# EAGLE schematic mainboard (EAGLE 9.4.0)
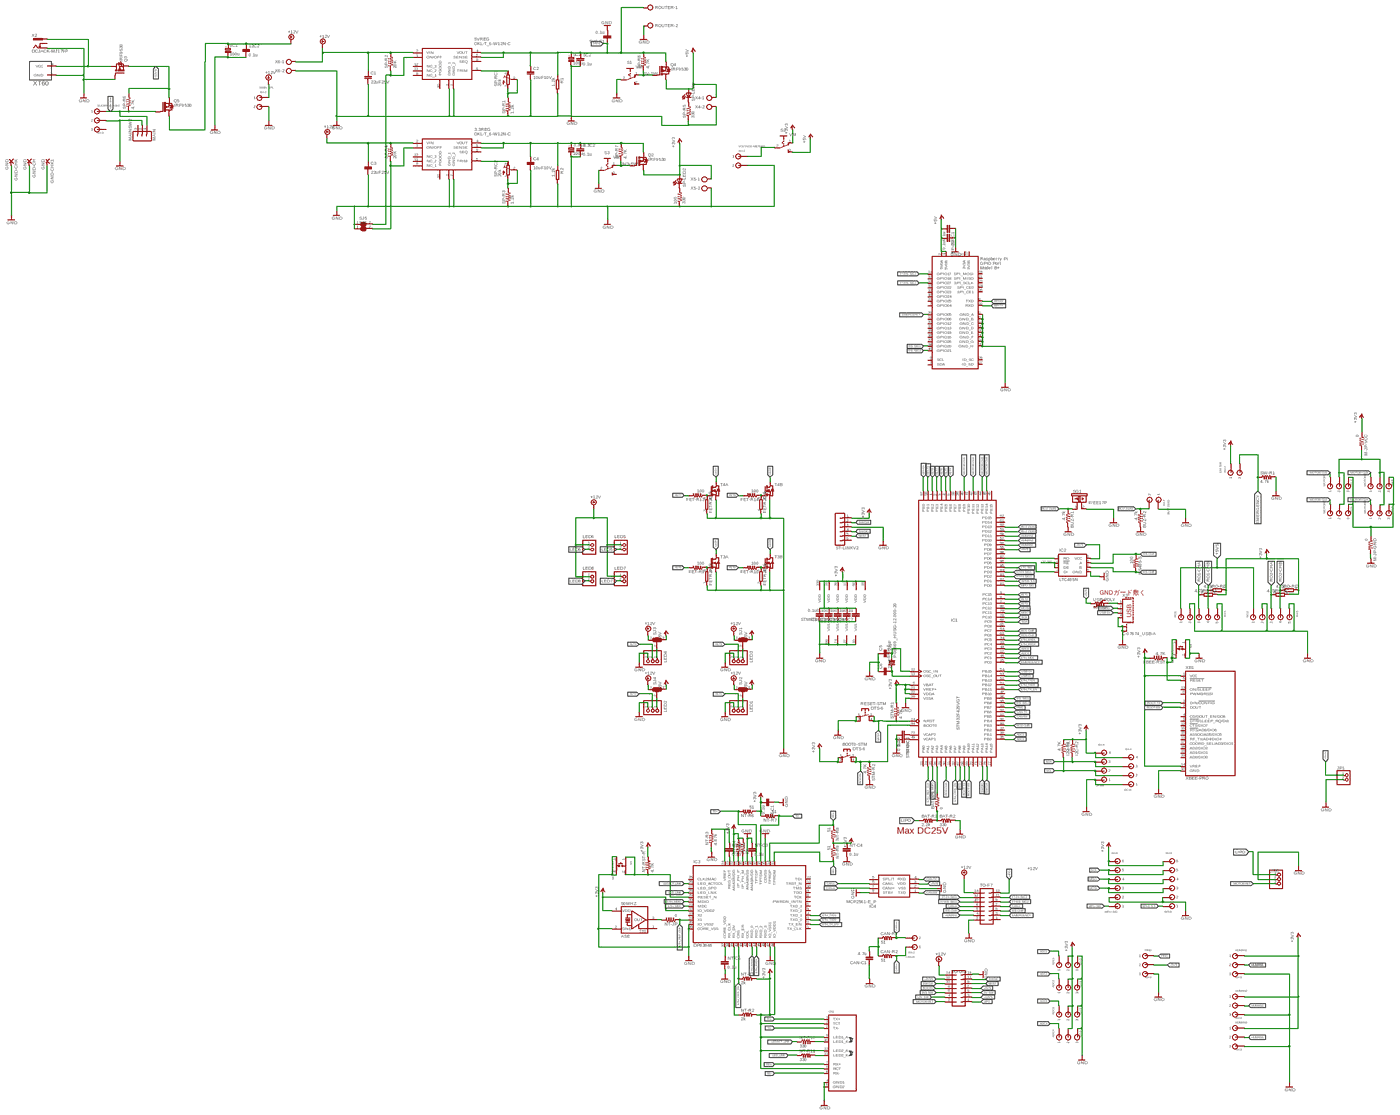
[diagram p0: schematic, sheet 1, overview]
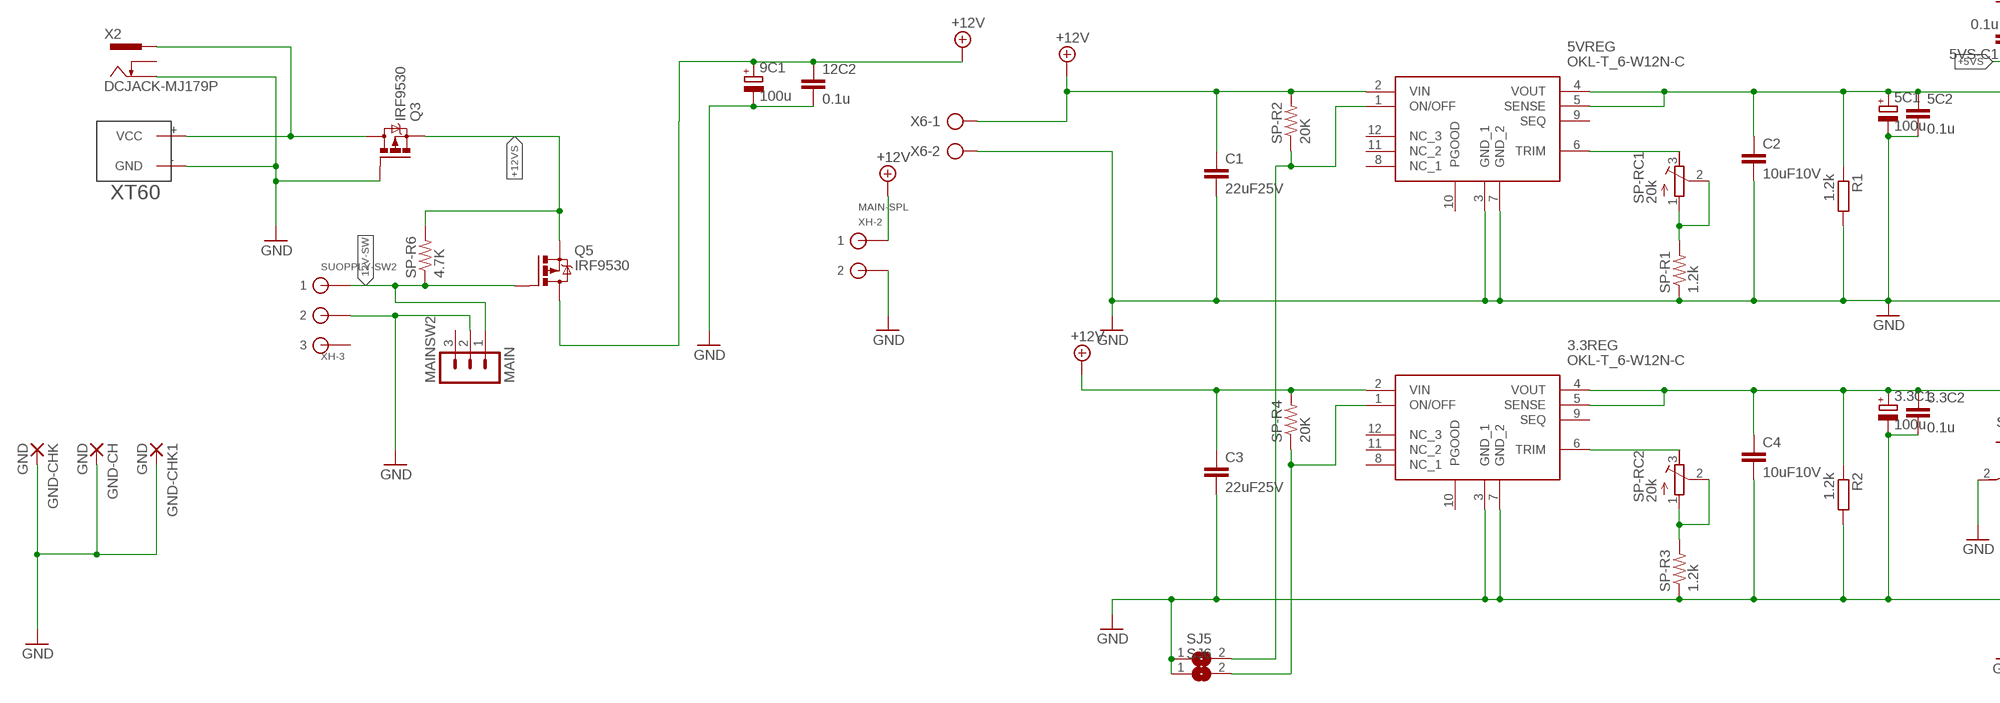
[diagram p1: schematic, sheet 1, part 1 of 4]
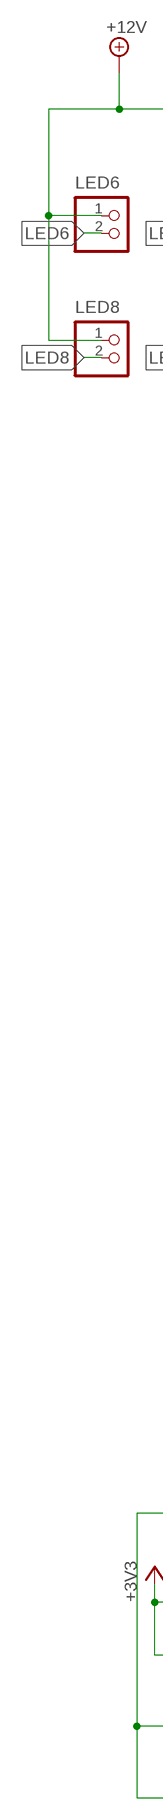
[diagram p2: schematic, sheet 1, part 2 of 4]
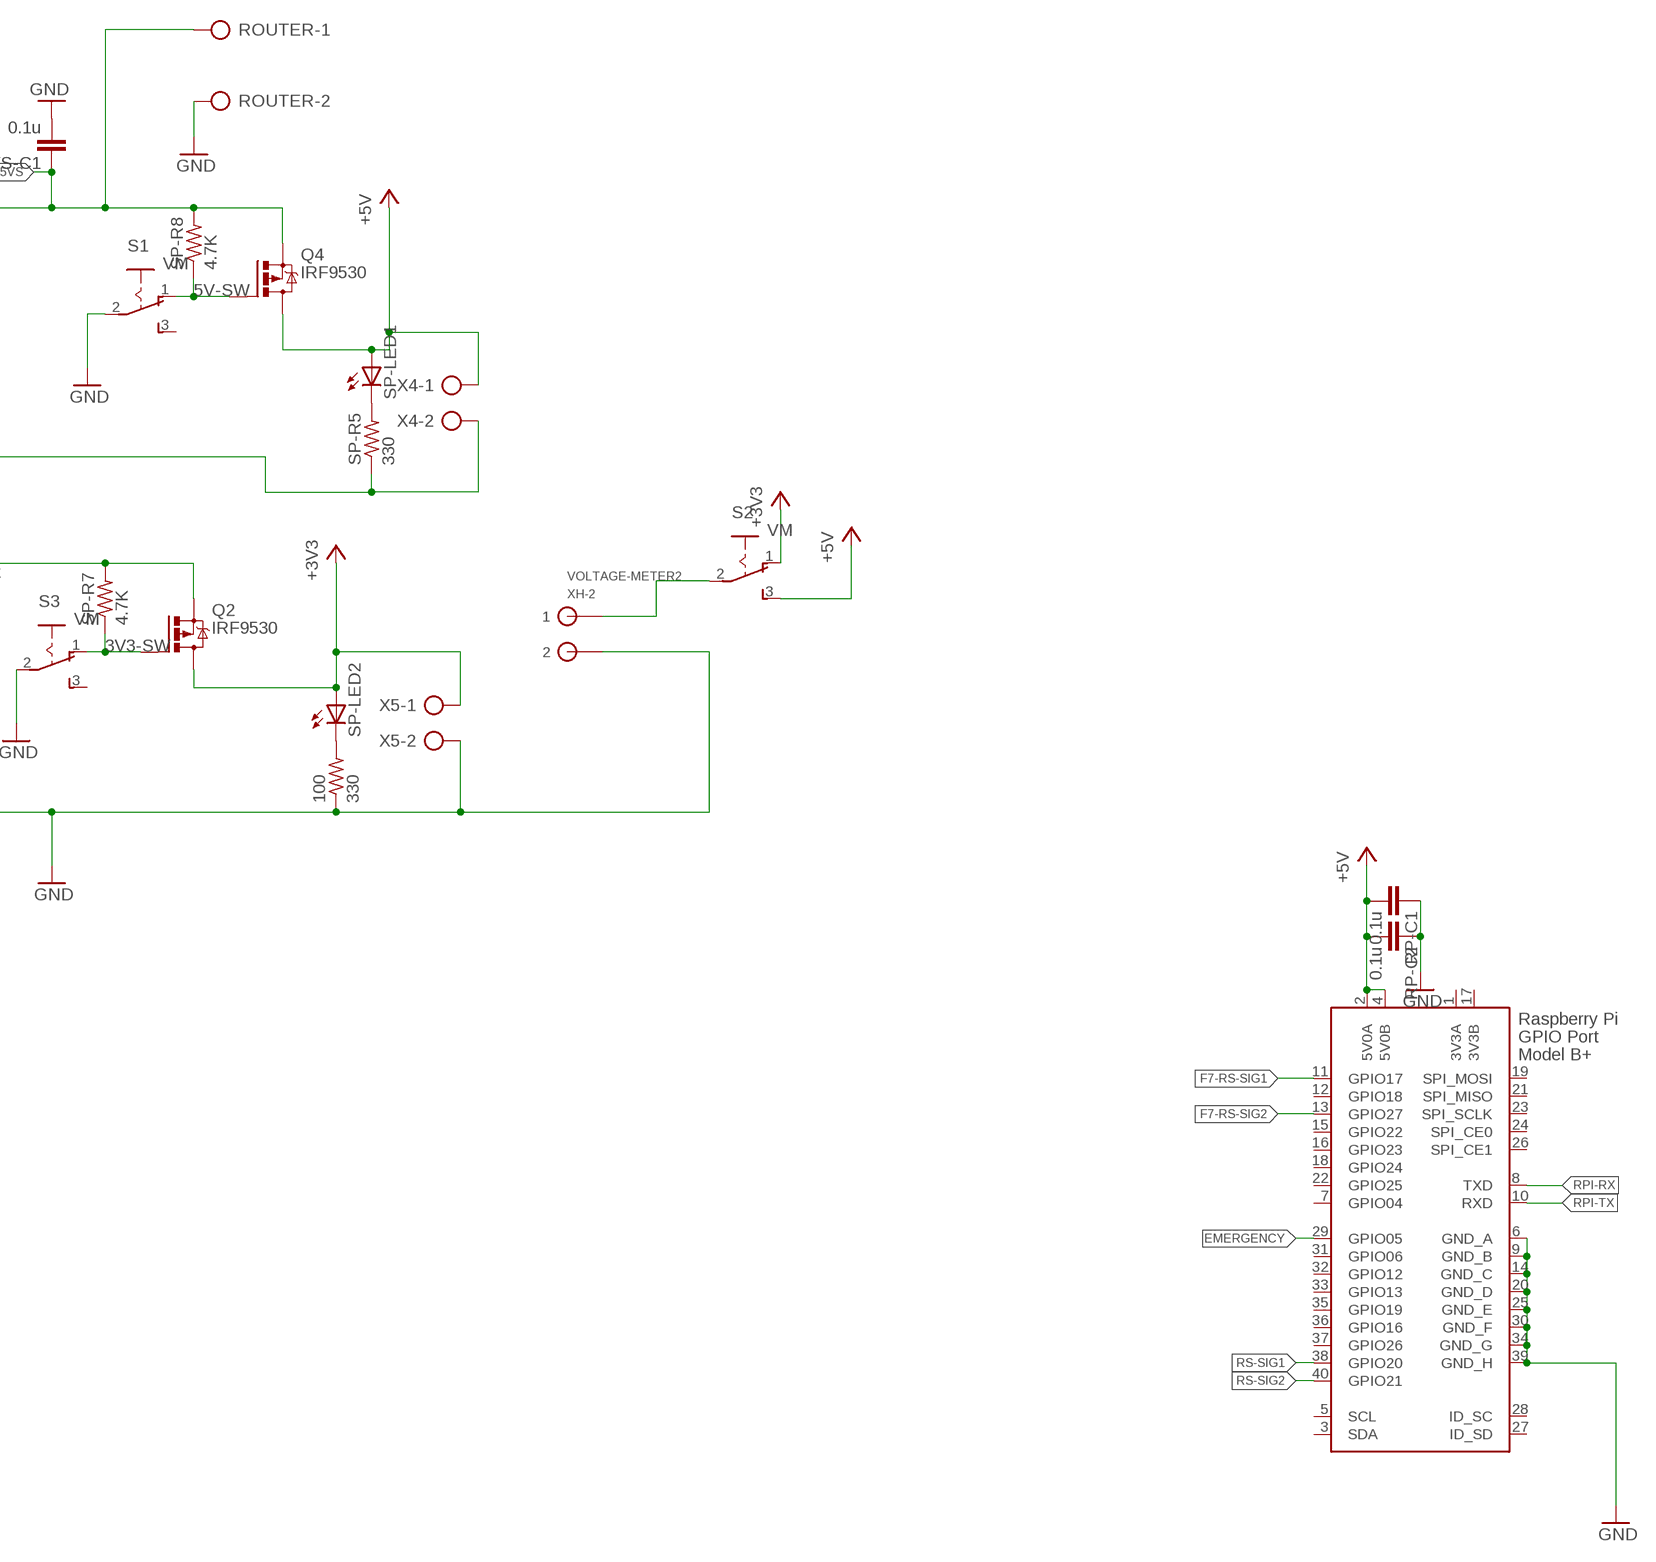
[diagram p3: schematic, sheet 1, part 3 of 4]
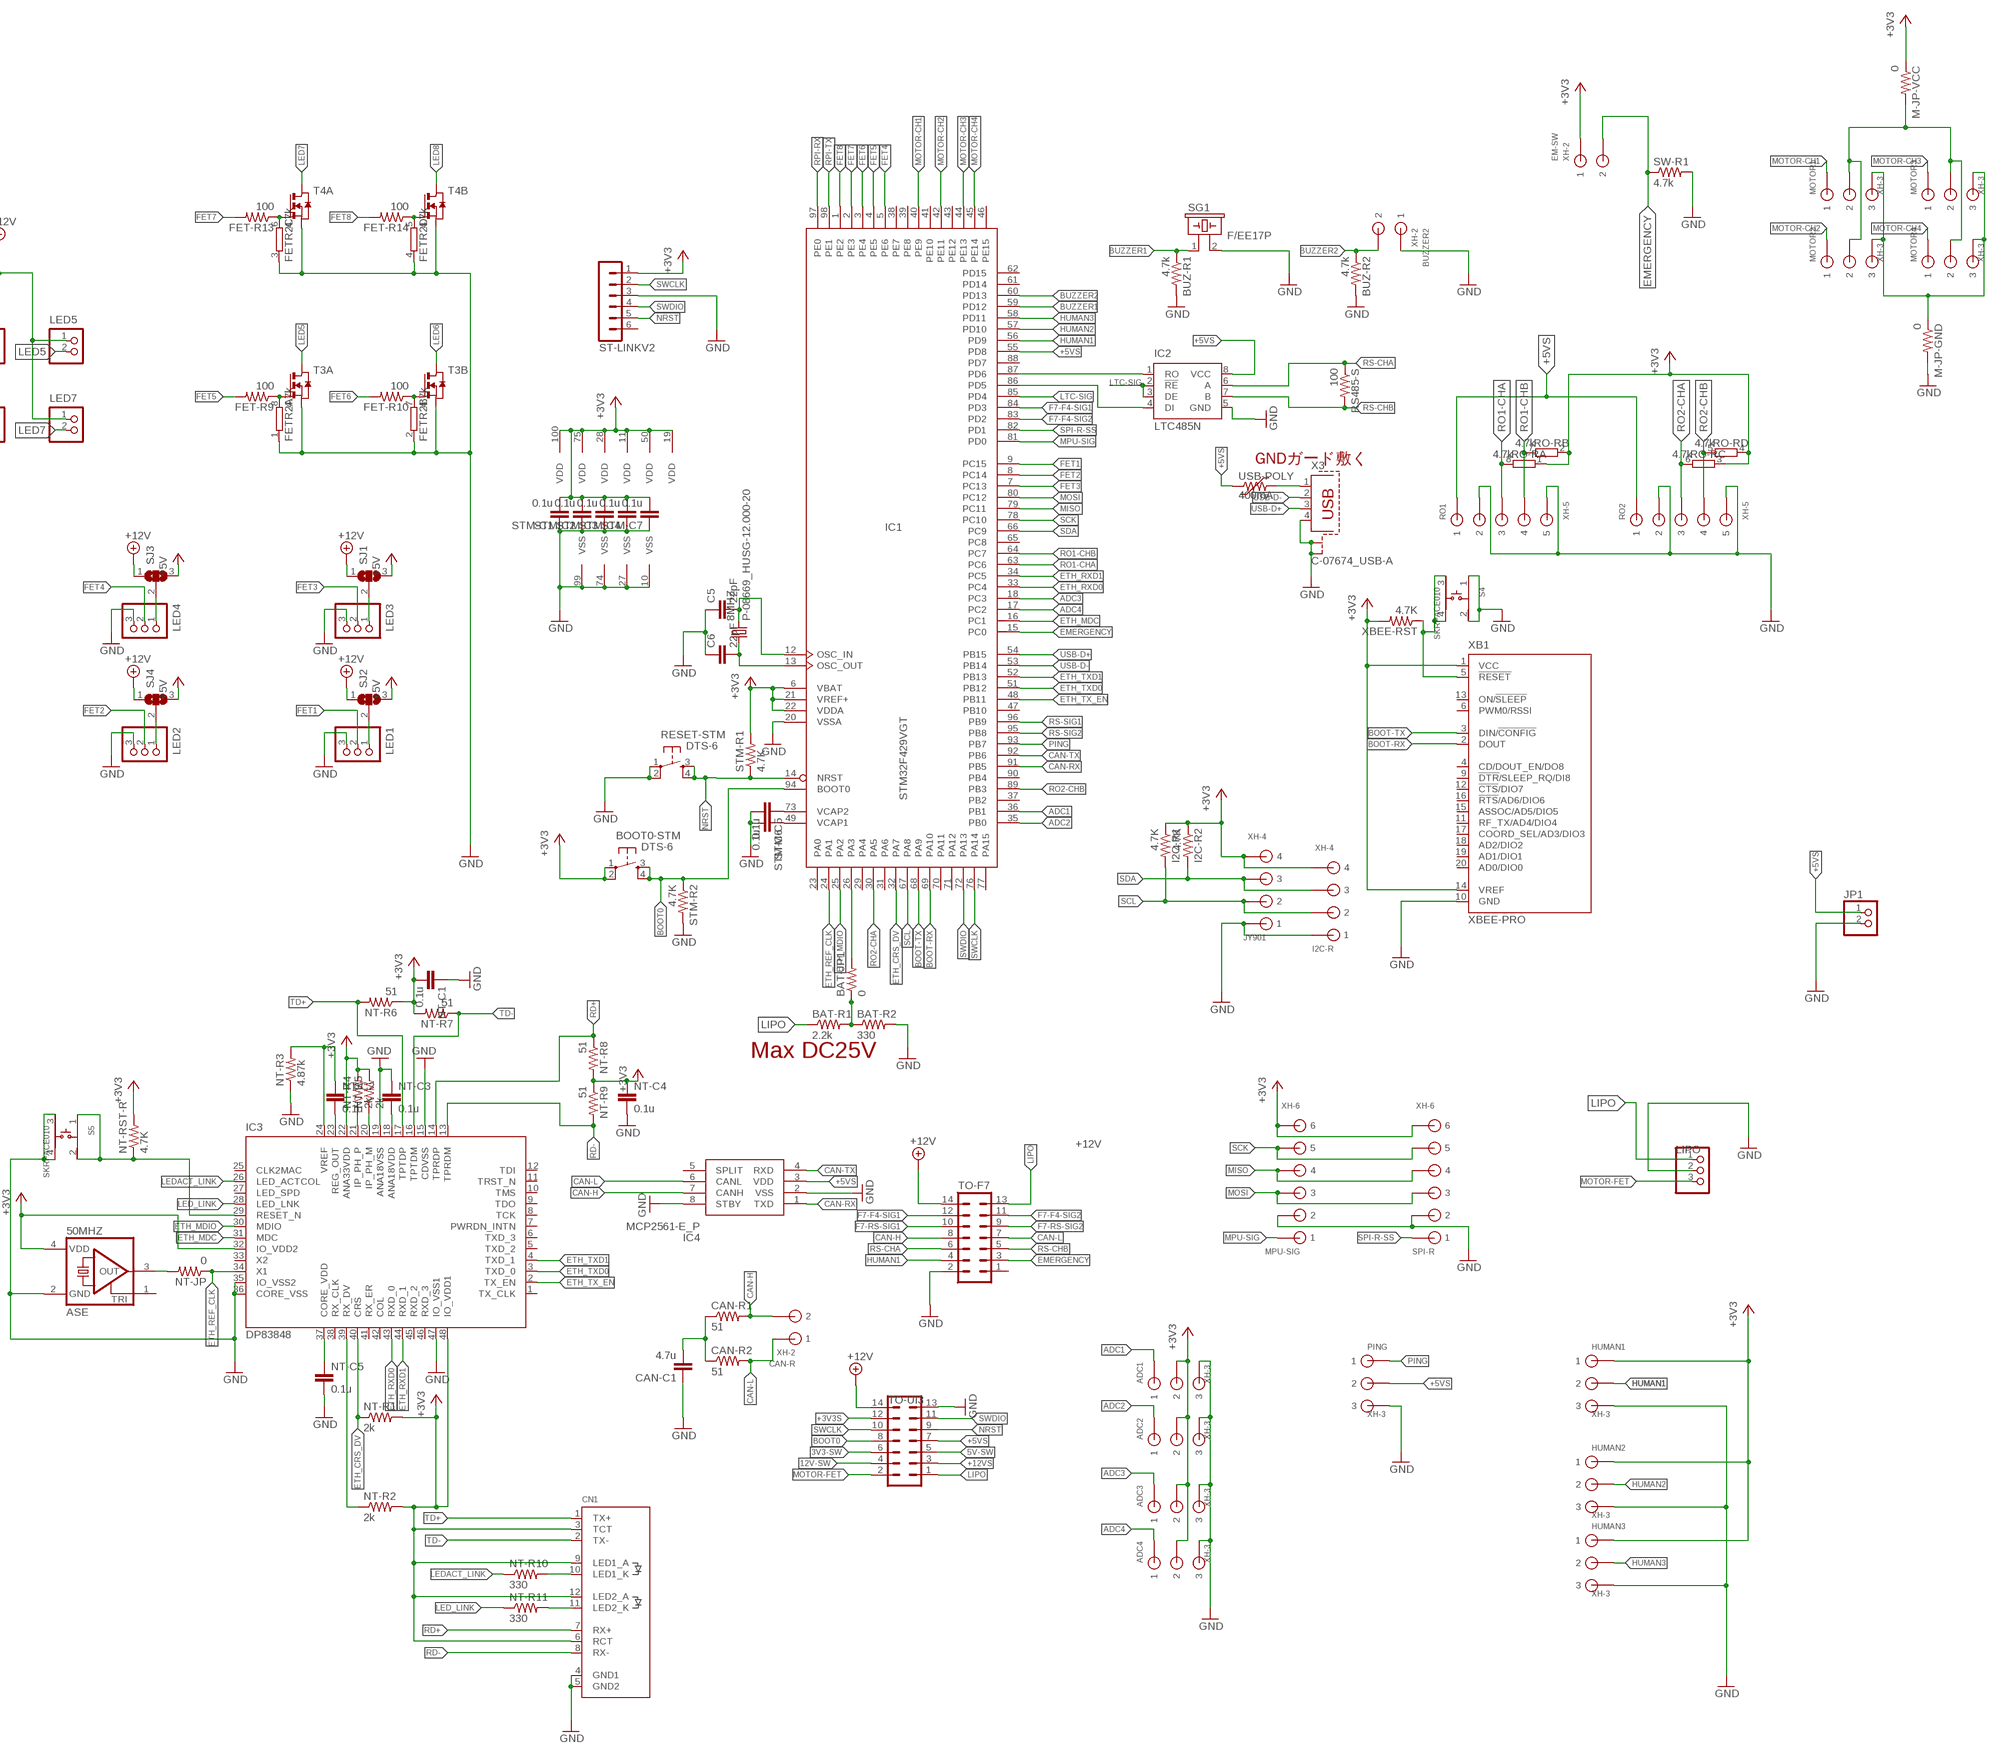
[diagram p4: schematic, sheet 1, part 4 of 4]

## Parts
3.3C1  100u  CPOL-EUD/7343-31R  [D/7343-31R]
3.3C2  0.1u  C-EUC0805  [C0805]
3.3REG  OKL-T_6-W12N-C  [OKL-T/3-W5]
5C1  100u  CPOL-EUD/7343-31R  [D/7343-31R]
5C2  0.1u  C-EUC0805  [C0805]
5VREG  OKL-T_6-W12N-C  [OKL-T/3-W5]
5VS-C1  0.1u  C-EUC0805  [C0805]
8MHZ  P-08669_HUSG-12.000-20  [HC49U-V]
9C1  100u  CPOL-EUD/7343-31R  [D/7343-31R]
12C2  0.1u  C-EUC0805  [C0805]
50MHZ  ASE  [ASE]
100  330  R-US_R0805  [R0805]
ADC1  XH-3  [CON3]
ADC2  XH-3  [CON3]
ADC3  XH-3  [CON3]
ADC4  XH-3  [CON3]
BAT-JP1  0  R-US_R0805  [R0805]
BAT-R1  2.2k  R-US_R0805  [R0805]
BAT-R2  330  R-US_R0805  [R0805]
BOOT0-STM  DTS-6  [DTS-6]
BUZ-R1  4.7k  R-US_R0805  [R0805]
BUZ-R2  4.7k  R-US_R0805  [R0805]
BUZZER2  XH-2  [CON2]
C1  22uF25V  C-EUC2012  [C2012]
C2  10uF10V  C-EUC2012  [C2012]
C3  22uF25V  C-EUC2012  [C2012]
C4  10uF10V  C-EUC2012  [C2012]
C5  22pF  C-EUC1608  [C1608]
C6  22pF  C-EUC1608  [C1608]
CAN-C1  4.7u  C-EUC0805  [C0805]
CAN-R  XH-2  [CON2]
CAN-R1  51  R-US_R0805  [R0805]
CAN-R2  51  R-US_R0805  [R0805]
CN1  P-04809_RJLD260TC1  [RJ45_PULSEJACK]
EM-SW  XH-2  [CON2]
FET-R9  100  R-US_R0805  [R0805]
FET-R10  100  R-US_R0805  [R0805]
FET-R13  100  R-US_R0805  [R0805]
FET-R14  100  R-US_R0805  [R0805]
FETR2  4.7k  4R-NEXBN8V  [EXBN8V]
GND-CH  GND  SMD5  [SMD2,54-5,08]
GND-CHK  GND  2,15/1,0  [2,15/1,0]
GND-CHK1  GND  2,15/1,0  [2,15/1,0]
HUMAN1  XH-3  [CON3]
HUMAN2  XH-3  [CON3]
HUMAN3  XH-3  [CON3]
I2C-R  XH-4  [CON4]
I2C-R1  4.7K  R-US_R0805  [R0805]
I2C-R2  4.7K  R-US_R0805  [R0805]
IC1  STM32F429VGT  [LQFP100]
IC2  LTC485N  [DIL08]
IC3  DP83848  [LQFP48]
IC4  MCP2561-E_P  [DIP781W56P254L950H533Q8N]
JP1  PINHD-1X2/90  [1X02/90]
JY901  XH-4  [CON4]
LED1  B3P-VH  [B3P-VH]
LED2  B3P-VH  [B3P-VH]
LED3  B3P-VH  [B3P-VH]
LED4  B3P-VH  [B3P-VH]
LED5  B2P-VH  [B2P-VH]
LED6  B2P-VH  [B2P-VH]
LED7  B2P-VH  [B2P-VH]
LED8  B2P-VH  [B2P-VH]
LIPO  B3P-VH  [B3P-VH]
M-JP-GND  0  R-US_R0805  [R0805]
M-JP-VCC  0  R-US_R0805  [R0805]
MAIN-SPL  XH-2  [CON2]
MAINSW2  MAIN  MA03-1  [MA03-1]
MOTOR1  XH-3  [CON3]
MOTOR2  XH-3  [CON3]
MOTOR3  XH-3  [CON3]
MOTOR4  XH-3  [CON3]
MPU-SIG  XH-6  [CON6]
NT-C1  0.1u  C-EUC0805  [C0805]
NT-C2  0.1u  C-EUC0805  [C0805]
NT-C3  0.1u  C-EUC0805  [C0805]
NT-C4  0.1u  C-EUC0805  [C0805]
NT-C5  0.1u  C-EUC0805  [C0805]
NT-JP  0  R-US_R0805  [R0805]
NT-R1  2k  R-US_R0805  [R0805]
NT-R2  2k  R-US_R0805  [R0805]
NT-R3  4.87k  R-US_R0805  [R0805]
NT-R4  2k  R-US_R0805  [R0805]
NT-R5  2k  R-US_R0805  [R0805]
NT-R6  51  R-US_R0805  [R0805]
NT-R7  51  R-US_R0805  [R0805]
NT-R8  51  R-US_R0805  [R0805]
NT-R9  51  R-US_R0805  [R0805]
NT-R10  330  R-US_R0805  [R0805]
NT-R11  330  R-US_R0805  [R0805]
NT-RST-R  4.7K  R-US_R0805  [R0805]
PING  XH-3  [CON3]
Q2  IRF9530  [TO220BV]
Q3  IRF9530  [TO220BV]
Q4  IRF9530  [TO220BV]
Q5  IRF9530  [TO220BV]
R1  1.2k  R-EU_0204/7  [0204/7]
R2  1.2k  R-EU_0204/7  [0204/7]
RESET-STM  DTS-6  [DTS-6]
RO1  XH-5  [CON5]
RO2  XH-5  [CON5]
RO-R  4.7k  4R-NEXBN8V  [EXBN8V]
ROUTER  AK500/2-H  [AK500/2-H]
RP-C1  0.1u  C-EUC0805  [C0805]
RP-C2  0.1u  C-EUC0805  [C0805]
RS485-S  100  R-US_R0805  [R0805]
S1  VM  M251  [M251]
S2  VM  M251  [M251]
S3  VM  M251  [M251]
S4  SKRPACE010  [SW_SKRPACE010]
S5  SKRPACE010  [SW_SKRPACE010]
SG1  F/EE17P  [F/EE17P]
SJ1  SJ2WW  [SJ_2W]
SJ2  SJ2WW  [SJ_2W]
SJ3  SJ2WW  [SJ_2W]
SJ4  SJ2WW  [SJ_2W]
SJ5  SJ  [SJ]
SJ6  SJ  [SJ]
SP-LED1  LEDCHIPLED_0805  [CHIPLED_0805]
SP-LED2  LEDCHIPLED_0805  [CHIPLED_0805]
SP-R1  1.2k  R-US_R0805  [R0805]
SP-R2  20K  R-US_R0805  [R0805]
SP-R3  1.2k  R-US_R0805  [R0805]
SP-R4  20K  R-US_R0805  [R0805]
SP-R5  330  R-US_R0805  [R0805]
SP-R6  4.7K  R-US_R0805  [R0805]
SP-R7  4.7K  R-US_R0805  [R0805]
SP-R8  4.7K  R-US_R0805  [R0805]
SP-RC1  20k  R-TRIMM3296W  [RTRIM3296W]
SP-RC2  20k  R-TRIMM3296W  [RTRIM3296W]
SPI-R  XH-6  [CON6]
ST-LINKV2  MA06-1  [MA06-1]
STM-C1  0.1u  C-EUC0805  [C0805]
STM-C2  0.1u  C-EUC0805  [C0805]
STM-C3  0.1u  C-EUC0805  [C0805]
STM-C4  0.1u  C-EUC0805  [C0805]
STM-C5  0.1u  C-EUC0805  [C0805]
STM-C6  0.1u  C-EUC0805  [C0805]
STM-C7  0.1u  C-EUC0805  [C0805]
STM-R1  4.7K  R-US_R0805  [R0805]
STM-R2  4.7K  R-US_R0805  [R0805]
SUOPPLY-SW2  XH-3  [CON3]
SW-R1  4.7k  R-US_R0805  [R0805]
T3  NMOS2SO8  [SO8]
T4  NMOS2SO8  [SO8]
TO-F7  ML14  [ML14]
TO-UI3  ML14  [ML14]
U$2  XT60  [XT60]
USB-POLY  400mA  PTC-F0805MP  [F0805MP]
VOLTAGE-METER2  XH-2  [CON2]
X1  RASPI_BOARD_B+#_FP  [RASPI_BOARD_B+_FULL_PAD]
X2  DCJACK-MJ179P  [MJ-179P]
X3  C-07674_USB-A  [PN87520-S]
X4  AK500/2  [AK500/2]
X5  AK500/2  [AK500/2]
X6  AK500/2  [AK500/2]
XB1  XBEE-PRO  [XBEE-PRO]
XBEE-RST  4.7K  R-US_R0805  [R0805]

## Nets
3V3-SW: Q2.G S3.1(O) SP-R7.1 TO-UI3.6
5V-SW: Q4.G S1.1(O) SP-R8.1 TO-UI3.5
12V-B: Q3.D U$2.+(VCC) X2.1
12V-SW: MAINSW2.1 Q5.G SP-R6.1 SUOPPLY-SW2.P$1 TO-UI3.4
+3V3: 50MHZ.4(VDD) ADC1.P$2 ADC2.P$2 ADC3.P$2 ADC4.P$2 BOOT0-STM.1 BOOT0-STM.2 CN1.3(TCT) CN1.6(RCT) CN1.9(LED1_A) CN1.12(LED2_A) EM-SW.P$1 HUMAN1.P$1 HUMAN2.P$1 HUMAN3.P$1 I2C-R1.1 I2C-R2.1 I2C-R.P$4 IC1.6(VBAT) IC1.11(VDD) IC1.19(VDD) IC1.21(VREF+) IC1.22(VDDA) IC1.28(VDD) IC1.50(VDD) IC1.75(VDD) IC1.100(VDD) IC3.22(ANA33VDD) IC3.32(IO_VDD2) IC3.48(IO_VDD1) JY901.P$4 M-JP-VCC.1 MPU-SIG.P$6 NT-C1.2 NT-C4.1 NT-R1.2 NT-R2.2 NT-R4.2 NT-R5.2 NT-R6.1 NT-R7.2 NT-R8.2 NT-R9.1 NT-RST-R.2 Q2.D RO-R.1 RO-R.2 RO-R.3 RO-R.4 S2.1(O) SP-LED2.A SPI-R.P$6 ST-LINKV2.1 STM-C1.2 STM-C2.2 STM-C3.2 STM-C4.2 STM-C7.2 STM-R1.2 X5.1 XB1.1(VCC) XB1.14(VREF) XBEE-RST.2
+3V3S: 3.3C1.+ 3.3C2.1 3.3REG.4(VOUT) 3.3REG.5(SENSE) C4.1 Q2.S R2.1 SP-R7.2 TO-UI3.12
+5V: Q4.D RP-C1.2 RP-C2.2 S2.3(S) SJ1.3 SJ2.3 SJ3.3 SJ4.3 SP-LED1.A X1.2(5V0A) X1.4(5V0B) X4.1
+5VS: 5C1.+ 5C2.1 5VREG.4(VOUT) 5VREG.5(SENSE) 5VS-C1.1 C2.1 IC1.55(PD8) IC2.8(VCC) IC4.3(VDD) JP1.1 PING.P$2 Q4.S R1.1 RO1.P$1 RO2.P$1 ROUTER.1 SP-R8.2 TO-UI3.7 USB-POLY.1
+12V: 3.3REG.2(VIN) 5VREG.2(VIN) 9C1.+ 12C2.1 C1.1 C3.1 LED5.1 LED6.1 LED7.1 LED8.1 MAIN-SPL.P$1 Q5.D SJ1.1 SJ2.1 SJ3.1 SJ4.1 SP-R2.2 SP-R4.2 TO-F7.14 TO-UI3.14 X6.1
+12VS: Q3.S Q5.S SP-R6.2 TO-UI3.3
ADC1: ADC1.P$1 IC1.36(PB1)
ADC2: ADC2.P$1 IC1.35(PB0)
ADC3: ADC3.P$1 IC1.18(PC3)
ADC4: ADC4.P$1 IC1.17(PC2)
BOOT0: BOOT0-STM.3 BOOT0-STM.4 IC1.94(BOOT0) STM-R2.1 TO-UI3.8
BOOT-RX: IC1.69(PA10) XB1.2(DOUT)
BOOT-TX: IC1.68(PA9) XB1.3(DIN/!CONFIG)
BUZZER1: BUZ-R1.1 IC1.59(PD12) SG1.1
BUZZER2: BUZ-R2.1 BUZZER2.P$2 IC1.60(PD13)
CAN-H: CAN-R1.2 CAN-R.P$2 IC4.7(CANH) TO-F7.8
CAN-L: CAN-R2.2 CAN-R.P$1 IC4.6(CANL) TO-F7.7
CAN-RX: IC1.91(PB5) IC4.1(TXD)
CAN-TX: IC1.92(PB6) IC4.4(RXD)
EMERGENCY: EM-SW.P$2 IC1.15(PC0) SW-R1.1 TO-F7.3 X1.29(GPIO05)
ETH_CRS_DV: IC1.32(PA7) IC3.40(CRS) NT-R1.1
ETH_MDC: IC1.16(PC1) IC3.31(MDC)
ETH_MDIO: IC1.25(PA2) IC3.30(MDIO)
ETH_REF_CLK: IC1.24(PA1) IC3.34(X1) NT-JP.1
ETH_RXD0: IC1.33(PC4) IC3.43(RXD_0)
ETH_RXD1: IC1.34(PC5) IC3.44(RXD_1)
ETH_TX_EN: IC1.48(PB11) IC3.2(TX_EN)
ETH_TXD0: IC1.51(PB12) IC3.3(TXD_0)
ETH_TXD1: IC1.52(PB13) IC3.4(TXD_1)
F7-F4-SIG1: IC1.84(PD3) TO-F7.12
F7-F4-SIG2: IC1.83(PD2) TO-F7.11
F7-RS-SIG1: TO-F7.10 X1.11(GPIO17)
F7-RS-SIG2: TO-F7.9 X1.13(GPIO27)
FET1: IC1.9(PC15) LED1.2
FET2: IC1.8(PC14) LED2.2
FET3: IC1.7(PC13) LED3.2
FET4: IC1.5(PE6) LED4.2
FET5: FET-R9.2 IC1.4(PE5)
FET6: FET-R10.2 IC1.3(PE4)
FET7: FET-R13.2 IC1.2(PE3)
FET8: FET-R14.2 IC1.1(PE2)
GND: 3.3C1.- 3.3C2.2 3.3REG.3(GND_1) 3.3REG.7(GND_2) 5C1.- 5C2.2 5VREG.3(GND_1) 5VREG.7(GND_2) 5VS-C1.2 9C1.- 12C2.2 50MHZ.2(GND) 100.1 ADC1.P$3 ADC2.P$3 ADC3.P$3 ADC4.P$3 BAT-R2.2 BUZ-R1.2 BUZ-R2.2 BUZZER2.P$1 C1.2 C2.2 C3.2 C4.2 C5.1 C6.1 CAN-C1.1 CN1.4(GND1) CN1.5(GND2) FETR2.1 FETR2.2 FETR2.3 FETR2.4 GND-CH.1(P) GND-CHK1.1(P) GND-CHK.1(P) HUMAN1.P$3 HUMAN2.P$3 HUMAN3.P$3 I2C-R.P$1 IC1.10(VSS) IC1.20(VSSA) IC1.27(VSS) IC1.74(VSS) IC1.99(VSS) IC2.5(GND) IC3.15(CDVSS) IC3.19(ANA18VSS) IC3.35(IO_VSS2) IC3.36(CORE_VSS) IC3.47(IO_VSS1) IC4.2(VSS) IC4.8(STBY) JP1.2 JY901.P$1 LED1.3 LED2.3 LED3.3 LED4.3 LIPO.2 M-JP-GND.2 MAIN-SPL.P$2 MAINSW2.2 MPU-SIG.P$2 NT-C1.1 NT-C3.1 NT-C4.2 NT-C5.2 NT-R3.1 PING.P$3 Q3.G R1.2 R2.2 RESET-STM.1 RESET-STM.2 RO1.P$2 RO1.P$5 RO2.P$2 RO2.P$5 ROUTER.2 RP-C1.1 RP-C2.1 S1.2(P) S3.2(P) S4.1 S4.2 S5.3 S5.4 SG1.2 SJ5.1 SJ6.1 SP-R1.1 SP-R3.1 SP-R5.1 SPI-R.P$2 ST-LINKV2.3 STM-C1.1 STM-C2.1 STM-C3.1 STM-C4.1 STM-C5.2 STM-C6.2 STM-C7.1 STM-R2.2 SUOPPLY-SW2.P$2 SW-R1.2 T3.1(A:S) T3.3(B:S) T4.1(A:S) T4.3(B:S) TO-F7.2 TO-UI3.13 U$2.-(GND) VOLTAGE-METER2.P$2 X1.6(GND_A) X1.9(GND_B) X1.14(GND_C) X1.20(GND_D) X1.25(GND_E) X1.30(GND_F) X1.34(GND_G) X1.39(GND_H) X2.2 X3.4 X3.S1 X3.S2 X4.2 X5.2 X6.2 XB1.10(GND)
HUMAN1: HUMAN1.P$2 IC1.56(PD9) TO-F7.4
HUMAN2: HUMAN2.P$2 IC1.57(PD10)
HUMAN3: HUMAN3.P$2 IC1.58(PD11)
LED5: LED5.2 T3.7(A:D) T3.8(A:D)
LED6: LED6.2 T3.5(B:D) T3.6(B:D)
LED7: LED7.2 T4.7(A:D) T4.8(A:D)
LED8: LED8.2 T4.5(B:D) T4.6(B:D)
LED_LINK: IC3.28(LED_LNK) NT-R11.1
LEDACT_LINK: IC3.26(LED_ACTCOL) NT-R10.1
LIPO: BAT-R1.1 LIPO.1 TO-F7.13 TO-UI3.1
LTC-SIG: IC1.85(PD4) IC2.2(!RE) IC2.3(DE)
MISO: IC1.79(PC11) MPU-SIG.P$4 SPI-R.P$4
MOSI: IC1.80(PC12) MPU-SIG.P$3 SPI-R.P$3
MOTOR-CH1: IC1.40(PE9) MOTOR1.P$1
MOTOR-CH2: IC1.42(PE11) MOTOR2.P$1
MOTOR-CH3: IC1.44(PE13) MOTOR3.P$1
MOTOR-CH4: IC1.45(PE14) MOTOR4.P$1
MOTOR-FET: LIPO.3 TO-UI3.2
MPU-SIG: IC1.81(PD0) MPU-SIG.P$1
N$1: IC1.73(VCAP2) STM-C5.1
N$2: IC1.49(VCAP1) STM-C6.1
N$3: SP-R1.2 SP-RC1.1(A) SP-RC1.2(S)
N$4: CAN-C1.2 CAN-R1.1 CAN-R2.1
N$5: SP-LED1.C SP-R5.2
N$6: 50MHZ.3(OUT) NT-JP.2
N$7: SP-R3.2 SP-RC2.1(A) SP-RC2.2(S)
N$8: IC3.29(RESET_N) NT-RST-R.1 S5.1 S5.2
N$9: 5VREG.6(TRIM) SP-RC1.3(E)
N$10: IC3.23(REG_OUT) NT-C2.2
N$11: S2.2(P) VOLTAGE-METER2.P$1
N$13: 3.3REG.6(TRIM) SP-RC2.3(E)
N$15: 3.3REG.1(ON/OFF) SJ6.2 SP-R4.1
N$16: IC3.39(RX_DV) NT-R2.1
N$17: LED3.1 SJ1.2
N$18: IC3.21(IP_PH_P) NT-R4.1
N$19: IC1.87(PD6) IC2.1(RO)
N$20: IC1.86(PD5) IC2.4(DI)
N$21: IC3.24(VREF) NT-C2.1 NT-R3.2
N$22: IC3.20(IP_PH_M) NT-R5.1
N$23: IC3.18(ANA18VDD) NT-C3.2
N$24: 100.2 SP-LED2.C
N$25: 8MHZ.1 C6.2 IC1.13(OSC_OUT)
N$26: 5VREG.1(ON/OFF) SJ5.2 SP-R2.1
N$27: BAT-JP1.2 IC1.26(PA3)
N$28: IC3.37(CORE_VDD) NT-C5.1
N$31: 8MHZ.2 C5.2 IC1.12(OSC_IN)
N$32: LED1.1 SJ2.2
N$34: CN1.10(LED1_K) NT-R10.2
N$35: CN1.11(LED2_K) NT-R11.2
N$36: BAT-JP1.1 BAT-R1.2 BAT-R2.1
N$37: LED4.1 SJ3.2
N$39: M-JP-VCC.2 MOTOR1.P$2 MOTOR2.P$2 MOTOR3.P$2 MOTOR4.P$2
N$40: LED2.1 SJ4.2
N$41: M-JP-GND.1 MOTOR1.P$3 MOTOR2.P$3 MOTOR3.P$3 MOTOR4.P$3
N$42: S4.3 S4.4 XB1.5(!RESET) XBEE-RST.1
N$43: USB-POLY.2 X3.1
N$45: FET-R10.1 FETR2.7 T3.4(B:G)
N$46: FET-R9.1 FETR2.8 T3.2(A:G)
N$47: FET-R14.1 FETR2.5 T4.4(B:G)
N$48: FET-R13.1 FETR2.6 T4.2(A:G)
NRST: IC1.14(NRST) RESET-STM.3 RESET-STM.4 ST-LINKV2.5 STM-R1.1 TO-UI3.9
PING: IC1.93(PB7) PING.P$1
RD+: CN1.7(RX+) IC3.14(TPRDP) NT-R8.1
RD-: CN1.8(RX-) IC3.13(TPRDM) NT-R9.2
RO1-CHA: IC1.63(PC6) RO1.P$3 RO-R.8
RO1-CHB: IC1.64(PC7) RO1.P$4 RO-R.7
RO2-CHA: IC1.30(PA5) RO2.P$3 RO-R.6
RO2-CHB: IC1.89(PB3) RO2.P$4 RO-R.5
RPI-RX: IC1.97(PE0) X1.8(TXD)
RPI-TX: IC1.98(PE1) X1.10(RXD)
RS-CHA: IC2.6(A) RS485-S.1 TO-F7.6
RS-CHB: IC2.7(B) RS485-S.2 TO-F7.5
RS-SIG1: IC1.96(PB9) X1.38(GPIO20)
RS-SIG2: IC1.95(PB8) X1.40(GPIO21)
SCK: IC1.78(PC10) MPU-SIG.P$5 SPI-R.P$5
SCL: I2C-R1.2 I2C-R.P$2 IC1.67(PA8) JY901.P$2
SDA: I2C-R2.2 I2C-R.P$3 IC1.66(PC9) JY901.P$3
SPI-R-SS: IC1.82(PD1) SPI-R.P$1
SWCLK: IC1.76(PA14) ST-LINKV2.2 TO-UI3.10
SWDIO: IC1.72(PA13) ST-LINKV2.4 TO-UI3.11
TD+: CN1.1(TX+) IC3.17(TPTDP) NT-R6.2
TD-: CN1.2(TX-) IC3.16(TPTDM) NT-R7.1
USB-D+: IC1.54(PB15) X3.3
USB-D-: IC1.53(PB14) X3.2
Unconnected: 3.3REG.8(NC_1) 3.3REG.9(SEQ) 3.3REG.10(PGOOD) 3.3REG.11(NC_2) 3.3REG.12(NC_3) 5VREG.8(NC_1) 5VREG.9(SEQ) 5VREG.10(PGOOD) 5VREG.11(NC_2) 5VREG.12(NC_3) 50MHZ.1(TRI) IC1.23(PA0) IC1.29(PA4) IC1.31(PA6) IC1.37(PB2) IC1.38(PE7) IC1.39(PE8) IC1.41(PE10) IC1.43(PE12) IC1.46(PE15) IC1.47(PB10) IC1.61(PD14) IC1.62(PD15) IC1.65(PC8) IC1.70(PA11) IC1.71(PA12) IC1.77(PA15) IC1.88(PD7) IC1.90(PB4) IC3.1(TX_CLK) IC3.5(TXD_2) IC3.6(TXD_3) IC3.7(PWRDN_INTN) IC3.8(TCK) IC3.9(TDO) IC3.10(TMS) IC3.11(TRST_N) IC3.12(TDI) IC3.25(CLK2MAC) IC3.27(LED_SPD) IC3.33(X2) IC3.38(RX_CLK) IC3.41(RX_ER) IC3.42(COL) IC3.45(RXD_2) IC3.46(RXD_3) IC4.5(SPLIT) MAINSW2.3 S1.3(S) S3.3(S) ST-LINKV2.6 SUOPPLY-SW2.P$3 TO-F7.1 X1.3(SDA) X1.5(SCL) X1.7(GPIO04) X1.12(GPIO18) X1.15(GPIO22) X1.16(GPIO23) X1.18(GPIO24) X1.19(SPI_MOSI) X1.21(SPI_MISO) X1.22(GPIO25) X1.23(SPI_SCLK) X1.24(SPI_CE0) X1.26(SPI_CE1) X1.27(ID_SD) X1.28(ID_SC) X1.31(GPIO06) X1.32(GPIO12) X1.33(GPIO13) X1.35(GPIO19) X1.36(GPIO16) X1.37(GPIO26) X2.3 XB1.4(CD/DOUT_EN/DO8) XB1.6(PWM0/RSSI) XB1.9(!DTR!/SLEEP_RQ/DI8) XB1.11(RF_TX/AD4/DIO4) XB1.12(!CTS!/DIO7) XB1.13(ON/!SLEEP) XB1.15(ASSOC/AD5/DIO5) XB1.16(!RTS!/AD6/DIO6) XB1.17(COORD_SEL/AD3/DIO3) XB1.18(AD2/DIO2) XB1.19(AD1/DIO1) XB1.20(AD0/DIO0)

## Notes on the sheet
- GNDガード敷く
- Max DC25V

## Power pins joined to a net without a drawn wire
3V3A: X1.1(3V3A)
3V3B: X1.17(3V3B)

## Library data of the parts
3.3C1 5C1 9C1 = rcl:CPOL-EU: POLARIZED CAPACITOR, European symbol; SPICEPREFIX: B
3.3C2 5C2 12C2 = rcl:C-EU: CAPACITOR, European symbol; SPICEPREFIX: B
3.3REG 5VREG = SamacSys_Parts:OKL-T_6-W12N-C: MURATA POWER SOLUTIONS - OKL-T/6-W12N-C - DC/DC CONVERTER, 30W, ADJ OUTPUT Source: Datasheet <http://www.mouser.com/ds/2/281/okl-t6-w12-21493.pdf>; ARROW_PART_NUMBER: OKL-T/6-W12N-C; ARROW_PRICE/STOCK: https://www.arrow.com/en/products/okl-t6-w12n-c/murata-power-solutions; DESCRIPTION: MURATA POWER SOLUTIONS - OKL-T/6-W12N-C - DC/DC CONVERTER, 30W, ADJ OUTPUT; HEIGHT: mm; MANUFACTURER_NAME: Murata Electronics; MANUFACTURER_PART_NUMBER: OKL-T/6-W12N-C; RS_PART_NUMBER: 1736944P; RS_PRICE/STOCK: http://uk.rs-online.com/web/p/products/1736944P
5VS-C1 CAN-C1 NT-C1-NT-C5 RP-C1 RP-C2 STM-C1-STM-C7 = rcl:C-EU: CAPACITOR, European symbol
8MHZ = Akizuki:P-08669_HUSG-12.000-20
50MHZ = crystal:ASE: 3.3Vdc CMOS SMD CRYSTAL CLOCK OSCILLATOR SOurce: www.abracon.com; OC_FARNELL: unknown; OC_NEWARK: unknown
100 BAT-JP1 BAT-R1 BAT-R2 BUZ-R1 BUZ-R2 CAN-R1 CAN-R2 FET-R9 FET-R10 FET-R13 FET-R14 I2C-R1 I2C-R2 M-JP-GND M-JP-VCC NT-JP NT-R1-NT-R5 NT-R10 NT-R11 NT-RST-R RS485-S SP-R1-SP-R8 STM-R1 STM-R2 SW-R1 XBEE-RST = 0@Mylibrary-main1:R-US_: RESISTOR, American symbol
ADC1-ADC4 HUMAN1-HUMAN3 MOTOR1-MOTOR4 PING = 0@Mylibrary-main1:XH-3: low insertion CON
BOOT0-STM RESET-STM = forprint:DTS-6
BUZZER2 CAN-R EM-SW = 0@Mylibrary-main1:XH-2: low insertion CON
C1-C6 = resistor:C-EU: CAPACITOR, European symbol
CN1 = Akizuki:P-04809_RJLD260TC1: RJ45 (Ethernet) Connector RJ45 Connector with internal transformer and 2 LEDs (Yellow/Green). LEDs have max foreward-voltage of 2.5V. LEDs require an external resistor. RJ45_PULSEJACK: Digikey 553-1349-ND
FETR2 RO-R = resistor-dil:4R-N: Array Chip Resistor Source: RS Component / Phycomp; OC_FARNELL: unknown; OC_NEWARK: unknown
GND-CH = wirepad:SMD5: SMD PAD
GND-CHK GND-CHK1 = wirepad:2,15/1,0: THROUGH-HOLE PAD
I2C-R JY901 = 0@Mylibrary-main1:XH-4: Low insertion connector 4pin
IC1 = micro-stm_v3:STM32F429V*T: ARM 32-bit Cortex™-M3 CPU 180 MHz maximum frequency 1024 to 2048 Kbytes of Flash memory 256 kbytes of SRAM 82 GPIOs 1.8 to 3.6 V application supply
IC2 = linear-technology:LTC485: Low Power RS485 Interface Transceiver Source: http://www.linear.com/pc/downloadDocument.do?navId=H0,C1,C1007,C1017,P2064,D1718; OC_FARNELL: unknown; OC_NEWARK: unknown
IC3 = national-semiconductor:DP83848: PHYTER® - Extended Temperature Single Port 10/100 Mb/s Ethernet Physical Layer Transceiver Auto generated by make-symbol-device-package-bsdl.ulp Rev. 34 Source: dp83848yb.bsdl http://www.national.com/ds/DP/DP83848VYB.pdf; MPN: DP83848VYB; OC_FARNELL: 1286817; OC_NEWARK: 11N4484
IC4 = MCP2561-E_P:MCP2561-E_P: CAN Transceiver 1Mbps 5V 125degC PDIP8 Microchip MCP2561-E/P, CAN Transceiver 1-channel IEC 61000-4-2, 8-Pin PDIP Source: Datasheet <http://uk.rs-online.com/web/p/products/7990212>; ALLIED_NUMBER: 70415102; ALLIED_PRICE-STOCK: https://www.alliedelec.com/microchip-technology-inc-mcp2561-e-p/70415102/; DESCRIPTION: CAN Transceiver 1Mbps 5V 125degC PDIP8 Microchip MCP2561-E/P, CAN Transceiver 1-channel IEC 61000-4-2, 8-Pin PDIP; HEIGHT: 5.334mm; MANUFACTURER_NAME: Microchip; MANUFACTURER_PART_NUMBER: MCP2561-E/P; MOUSER_PART_NUMBER: 579-MCP2561-E/P; MOUSER_PRICE-STOCK: https://www.mouser.com/Search/Refine.aspx?Keyword=579-MCP2561-E%2FP; RS_PART_NUMBER: 1652124; RS_PRICE-STOCK: http://uk.rs-online.com/web/p/products/1652124
JP1 = 0pinhead:PINHD-1X2: PIN HEADER
LED1-LED4 LIPO = jst-vh:B3P-VH: Wire-to-Board 3.96mm pitch top mount connector Source: http://www.jst-mfg.com/product/pdf/jpn/VH.pdf http://www.jst-mfg.com/product/detail.php?series=262
LED5-LED8 = jst-vh:B2P-VH: Wire-to-Board 3.96mm pitch top mount connector Source: http://www.jst-mfg.com/product/pdf/jpn/VH.pdf http://www.jst-mfg.com/product/detail.php?series=262
MAIN-SPL VOLTAGE-METER2 = forprint:XH-2: low insertion CON
MAINSW2 = 0con-lstb:MA03-1: PIN HEADER; OC_FARNELL: unknown; OC_NEWARK: unknown
MPU-SIG SPI-R = 0@Mylibrary-main1:XH-6: low insertion connector 6
NT-R6-NT-R9 = resistor:R-US_: RESISTOR, American symbol
Q2-Q5 = transistor-power:IRF9530: P-CHANNEL HEXFET POWER-MOS-FET Source: http://www.irf.com/product-info/datasheets/data/irf9530.pdf
R1 R2 = resistor:R-EU_: RESISTOR, European symbol
RO1 RO2 = 0@Mylibrary-main1:XH-5: Low insertion connector 5P
ROUTER = con-ptr500:AK500/2-H: CONNECTOR Aug. 2004 / PTR Meßtechnik: Die Bezeichnung der Serie AK505 wurde geändert. Es handelt sich hierbei um AK500 in horizontaler Ausführung.; OC_FARNELL: unknown; OC_NEWARK: unknown
S1-S3 = switch-k:M251: SLIDING SWITCH Mors, distributor Buerklin, 11G702
S4 S5 = SKRPACE010:SKRPACE010: Switch Tactile N.O. SPST Button J-Bend 0.05A 16VDC 2.55N SMD Automotive T/R; AVAILABILITY: Unavailable; DESCRIPTION: Switch Tactile N.O. SPST Button J-Bend 0.05A 16VDC 2.55N SMD Automotive T/R; MF: ALPS; MP: SKRPACE010; PACKAGE: None; PRICE: None
SG1 = buzzer:F/EE17P: BUZZER Source: Buerklin; OC_FARNELL: unknown; OC_NEWARK: unknown
SJ1-SJ4 = jumper:SJ2W: SMD solder JUMPER
SJ5 SJ6 = jumper:SJ: SMD solder JUMPER
SP-LED1 SP-LED2 = led:LED: LED OSRAM: - CHIPLED LG R971, LG N971, LY N971, LG Q971, LY Q971, LO R971, LY R971 LH N974, LH R974 LS Q976, LO Q976, LY Q976 LO Q996 - Hyper CHIPLED LW Q18S LB Q993, LB Q99A, LB R99A - SideLED LS A670, LO A670, LY A670, LG A670, LP A670 LB A673, LV A673, LT A673, LW A673 LH A674 LY A675 LS A676, LA A676, LO A676, LY A676, LW A676 LS A679, LY A679, LG A679 - Hyper Micro SIDELED® LS Y876, LA Y876, LO Y876, LY Y876 LT Y87S - SmartLED LW L88C, LW L88S LB L89C, LB L89S, LG L890 LS L89K, LO L89K, LY L89K LS L896, LA L896, LO L896, LY L896 - TOPLED LS T670, LO T670, LY T670, LG T670, LP T670 LSG T670, LSP T670, LSY T670, LOP T670, LYG T670 LG T671, LOG T671, LSG T671 LB T673, LV T673, LT T673, LW T673 LH T674 LS T676, LA T676, LO T676, LY T676, LB T676, LH T676, LSB T676, LW T676 LB T67C, LV T67C, LT T67C, LS T67K, LO T67K, LY T67K, LW E67C LS E67B, LA E67B, LO E67B, LY E67B, LB E67C, LV E67C, LT E67C LW T67C LS T679, LY T679, LG T679 LS T770, LO T770, LY T770, LG T770, LP T770 LB T773, LV T773, LT T773, LW T773 LH T774 LS E675, LA E675, LY E675, LS T675 LS T776, LA T776, LO T776, LY T776, LB T776 LHGB T686 LT T68C, LB T68C - Hyper Mini TOPLED® LB M676 - Mini TOPLED Santana® LG M470 LS M47K, LO M47K, LY M47K Source: http://www.osram.convergy.de LUXEON: - LUMILED® LXK2-PW12-R00, LXK2-PW12-S00, LXK2-PW14-U00, LXK2-PW14-V00 LXK2-PM12-R00, LXK2-PM12-S00, LXK2-PM14-U00 LXK2-PE12-Q00, LXK2-PE12-R00, LXK2-PE12-S00, LXK2-PE14-T00, LXK2-PE14-U00 LXK2-PB12-K00, LXK2-PB12-L00, LXK2-PB12-M00, LXK2-PB14-N00, LXK2-PB14-P00, LXK2-PB14-Q00 LXK2-PR12-L00, LXK2-PR12-M00, LXK2-PR14-Q00, LXK2-PR14-R00 LXK2-PD12-Q00, LXK2-PD12-R00, LXK2-PD12-S00 LXK2-PH12-R00, LXK2-PH12-S00 LXK2-PL12-P00, LXK2-PL12-Q00, LXK2-PL12-R00 Source: www.luxeon.com KINGBRIGHT: KA-3528ASYC Source: www.kingbright.com
SP-RC1 SP-RC2 = resistor:R-TRIMM: Trimm resistor
ST-LINKV2 = 0con-lstb:MA06-1: PIN HEADER; OC_FARNELL: unknown; OC_NEWARK: unknown
SUOPPLY-SW2 = forprint:XH-3: low insertion CON
T3 T4 = zetex:NMOS2: Dual MOS FET; OC_FARNELL: unknown; OC_NEWARK: unknown
TO-F7 TO-UI3 = 0con-harting-ml:ML14: HARTING; OC_FARNELL: unknown; OC_NEWARK: unknown
U$2 = XT60:XT60: XT60
USB-POLY = polyswitch:PTC-: POLYSWITCH Polyswitch Resetable Fuses
X1 = raspberrypi_bastelstube_v13:RASPI_BOARD_B+#: Raspberry Pi GPIO connector with markings for the outer dimensions of the Raspberry Pi board model B+ with different sets of drill holes or mounting pads All pins connected
X2 = kamiki-dcjack:DCJACK: DC JACK 2.1mmφ - 5.5mmφ DCジャック、基板用。
X3 = Akizuki:C-07674_USB-A; OC_FARNELL: unknown; OC_NEWARK: unknown
X4-X6 = con-ptr500:AK500/2: CONNECTOR; OC_FARNELL: unknown; OC_NEWARK: unknown
XB1 = maxstream:XBEE: XBee (TM) /XBee-PRO(TM) OEM RF Modules Source: MaxStream, Inc. xbee_productmanual.pdf; MPN: XBP24-AWI-001; OC_FARNELL: 1337916; OC_NEWARK: 42M2667